# EAGLE design USB_Host (EAGLE 9.3.0)
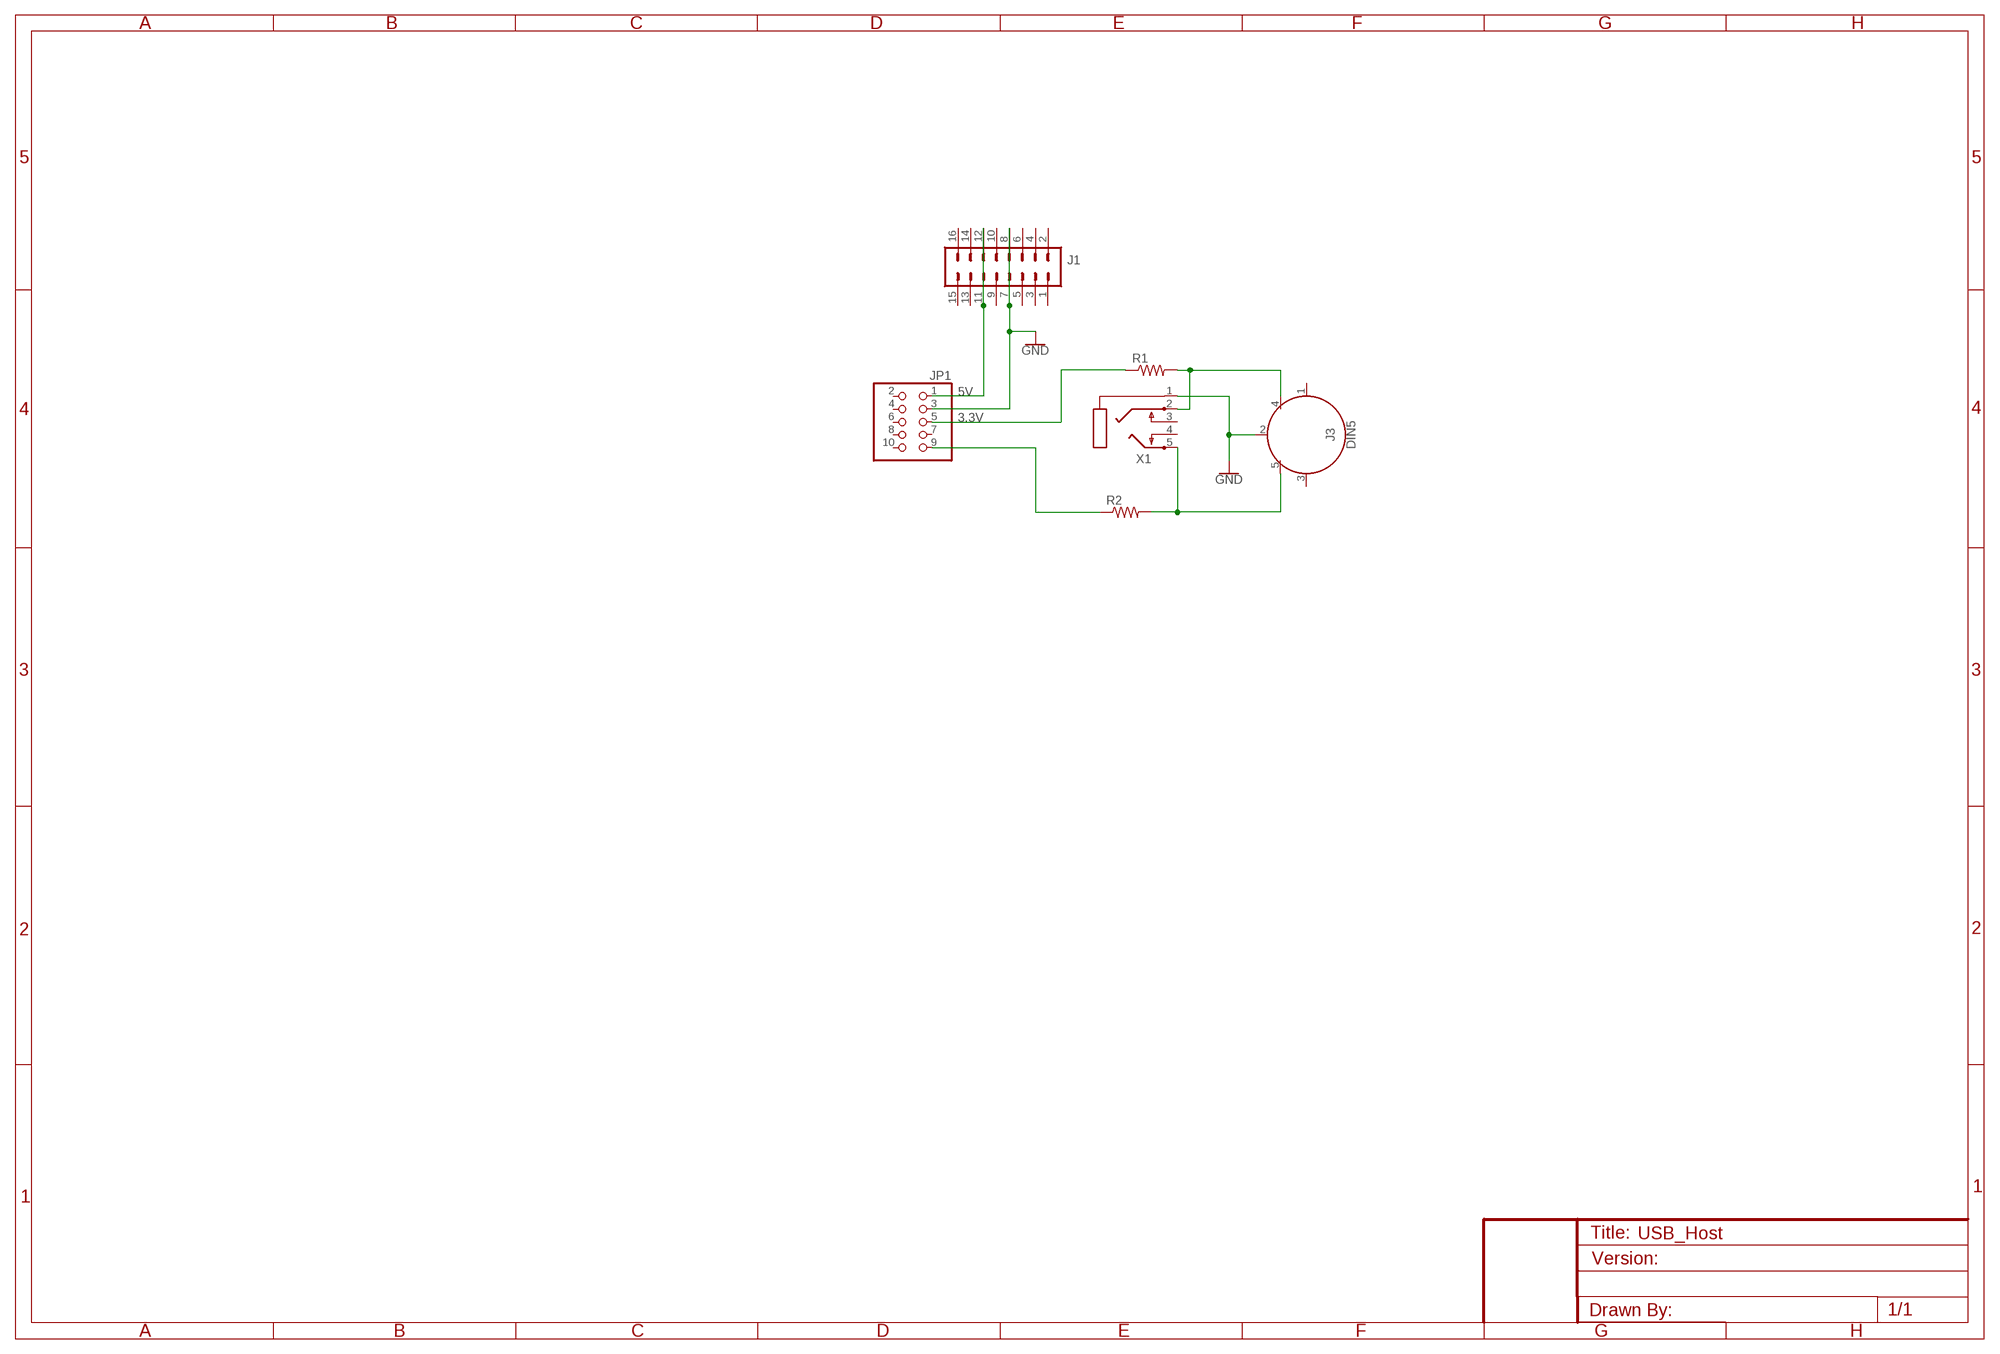
[diagram p0: schematic, sheet 1]

## Parts
J1  CONN_08X2_SHROUD  [2X8-SHROUDED_LOCK]
J3  DIN5  [DIN5-RA-PTH]
JP1  PINHD-2X5  [2X05]
R1  68  R-US_0204/7  [0204/7]
R2  68  R-US_0204/7  [0204/7]
X1  PG203J  [PG203J]

## Nets
3.3V: JP1.5 R1.1
5V: J1.11 J1.12 JP1.1
GND: J1.7 J1.8 J3.2 JP1.3 X1.1
N$1: JP1.9 R2.1
N$3: J3.4 R1.2 X1.2
N$4: J3.5 R2.2 X1.5
Unconnected: J1.1 J1.2 J1.3 J1.4 J1.5 J1.6 J1.9 J1.10 J1.13 J1.14 J1.15 J1.16 J3.1 J3.3 JP1.2 JP1.4 JP1.6 JP1.7 JP1.8 JP1.10 X1.3 X1.4

## Library data of the parts
J1 = SparkFun-Connectors:CONN_08X2: Multi connection point. Often used as Generic Header-pin footprint for 0.1 inch spaced/style header connections You can populate with any combo of single row headers, but if you'd like an exact match, check this: Header - 2x8 (Male, 0.1") <https://www.sparkfun.com/products/13156> (PRT-13156) On any of the 0.1 inch spaced packages, you can populate with these: Break Away Headers - Straight <https://www.sparkfun.com/products/116> (PRT-00116) Break Away Male Headers - Right Angle <https://www.sparkfun.com/products/553> (PRT-00553) Female Headers <https://www.sparkfun.com/products/115> (PRT-00115) Break Away Headers - Machine Pin <https://www.sparkfun.com/products/117> (PRT-00117) Break Away Female Headers - Swiss Machine Pin <https://www.sparkfun.com/products/743> (PRT-00743)
J3 = SparkFun-Connectors:DIN5: DIN5 Connector - Female Right Angle (frequently used as a MIDI Jack connector) This type of connector and cable is frequently used for transmitting midi data (musical instrument digital interface). It is what you usually see on a keyboard or set of electronic drums. Learn more here <https://en.wikipedia.org/wiki/MIDI>. For more information on the pinout and electrical specifications of MIDI communications, please see the following resource: https://www.midi.org/specifications/item/midi-din-electrical-specification Here is the connector we sell at SparkFun: MIDI Connector - Female Right Angle <https://www.sparkfun.com/products/9536> (PRT-09536) Datasheet <hhttp://www.sparkfun.com/datasheets/Prototyping/Connectors/MIDI-RA.pdf> It is used on this SparkFun product: SparkFun MIDI Shield <https://www.sparkfun.com/products/12898> (DEV-12898); PROD_ID: CONN-09481
JP1 = pinhead:PINHD-2X5: PIN HEADER
R1 R2 = adafruit:R-US_: RESISTOR, American symbol
X1 = con-hirschmann:PG203J: MIC/HEADPHONE JACK KS-S stereo microphone/headphone jack PG203JN (Schukat); OC_FARNELL: unknown; OC_NEWARK: unknown

## Net classes
0 default: width 0.508 mm, drill 1.016 mm, clearance 0.508 mm

## Board
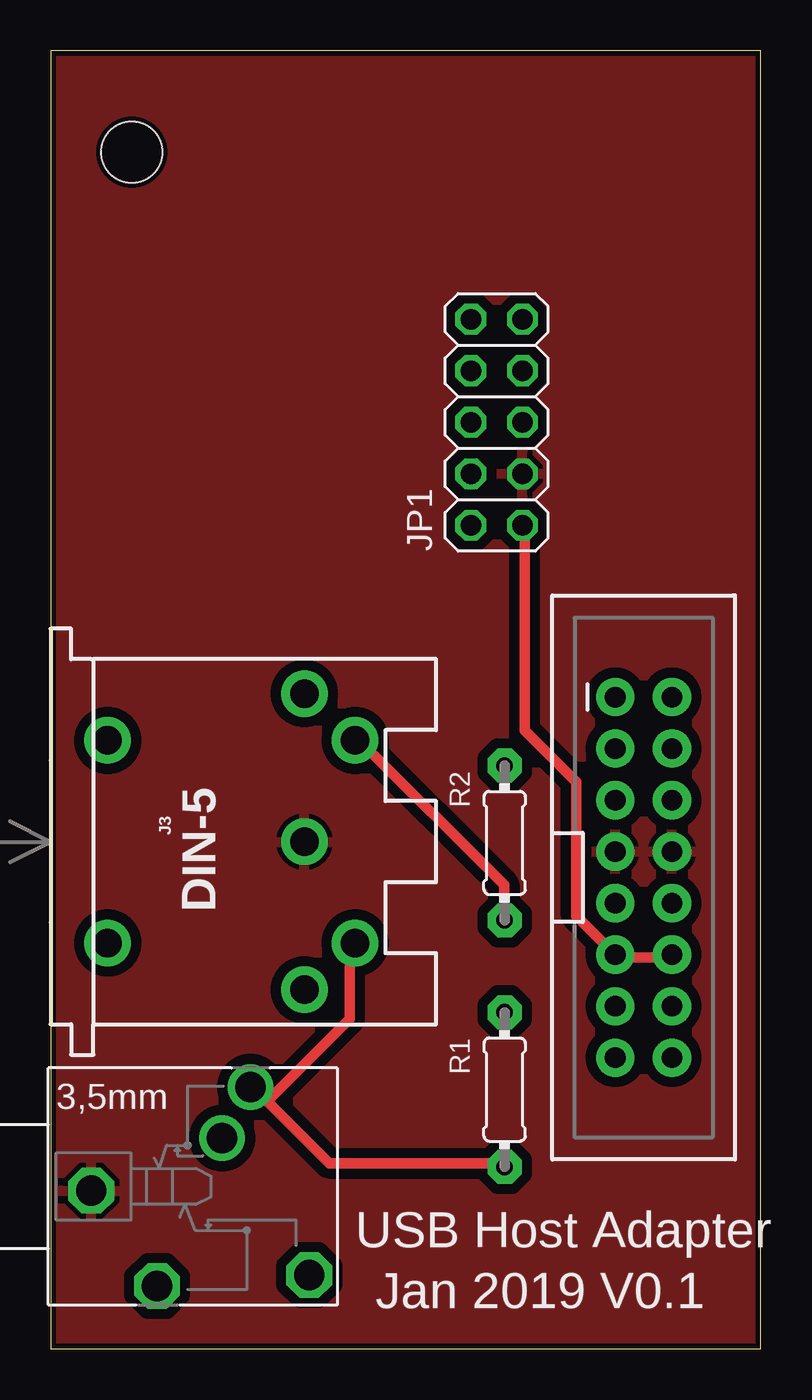
[diagram p1: board, top side]
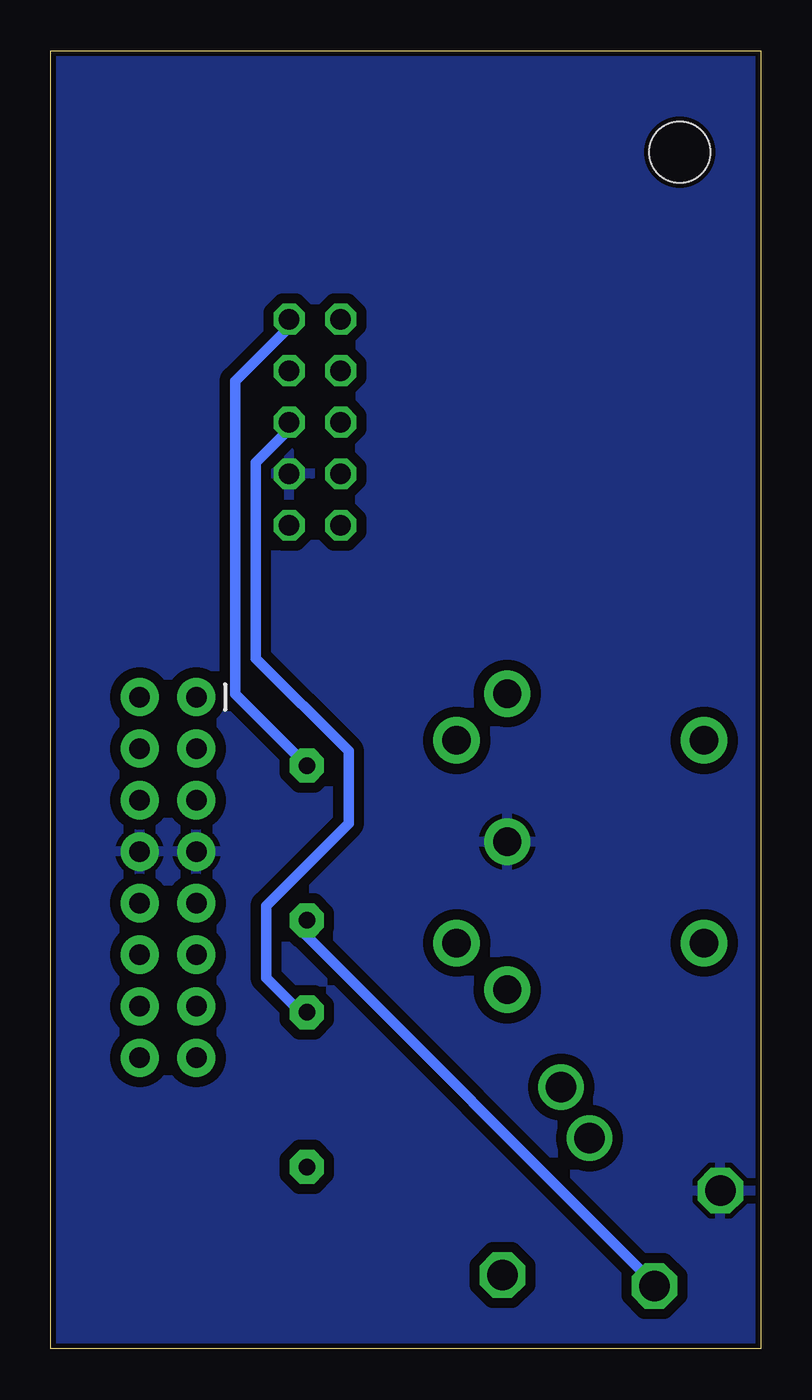
[diagram p2: board, bottom side, seen from below]

Size 35 x 64 mm. Coordinates in mm from the lower left corner, seen from the top.
Outline: 0,0 35,0 35,64 0,64 0,0
Copper layers (1*16): Top 0.035mm / dielectric 1.5mm / Bottom 0.035mm
Design rules "dirt_cheap_dirty_boards.v1.1": minimum track width 6mil, minimum drill 12mil, track to track 6mil, track to pad 6mil, pad to pad 6mil, via to via 6mil, smd to smd 0mil, copper to edge 10mil, drill to drill 10mil, minimum pad ring 10mil, minimum via ring 6mil, stop-mask expansion 2mil, vias tented up to drill 25mil, thermal gap 10mil
Holes 3 mm at 4,59

### Footprints (pad centres in the part's own frame; a part is rotated, then mirrored left to right if it is on the bottom)
2X8-SHROUDED_LOCK = drill 1.016 pad 1.88: 1 -1.397,8.89; 2 1.397,8.89; 3 -1.397,6.35; 4 1.397,6.35; 5 -1.397,3.81; 6 1.397,3.81; 7 -1.397,1.27; 8 1.397,1.27; 9 -1.397,-1.27; 10 1.397,-1.27; 11 -1.397,-3.81; 12 1.397,-3.81; 13 -1.397,-6.35; 14 1.397,-6.35; 15 -1.397,-8.89; 16 1.397,-8.89
DIN5-RA-PTH = drill 1.4 pad 2.286: 1 7.3,12.5; 2 0,12.5; 3 -7.3,12.5; 4 5,15; 5 -5,15; 6 -5,2.8; 7 5,2.8
2X05 = drill 1.016 octagon: 1 -5.08,-1.27; 2 -5.08,1.27; 3 -2.54,-1.27; 4 -2.54,1.27; 5 0,-1.27; 6 0,1.27; 7 2.54,-1.27; 8 2.54,1.27; 9 5.08,-1.27; 10 5.08,1.27
0204/7 = drill 0.813 pad 1.676 octagon: 1 -3.81,0; 2 3.81,0
PG203J = drill 1.499 octagon: 1 -5.004,-0.203; 4 5.74,-4.369; 5 -1.753,-4.902 | drill 1.499: 2 2.845,4.902; 3 1.448,2.388

### Placement (x,y rotation side)
J1  29.22,23.24 0 top
J3  0,25 270 top
JP1  21.98,45.68 90 top
R1  22.37,12.78 270 top
R2  22.37,24.94 270 top
X1  7,8 0 top

### Tracks (layer width: path | path; a pad name or v marks a point on that pad's centre or on a via)
3.3V
  Bottom 0.508: JP1.5 23.37,45.21 24.89,43.69 24.89,34.04 20.32,29.46 20.32,25.91 24.38,21.84 24.38,18.29 22.86,16.76 R1.1
5V
  Top 0.508: JP1.1 23.37,40.13 23.37,30.48 25.91,27.94 25.91,21.34 27.43,19.81 J1.11 27.94,19.3 30.48,19.3 J1.12
GND
  pour Bottom: 0,64 0,0 35,0 35,64
  pour Top: 0,64 0,0 35,0 35,64
N$1
  Bottom 0.508: JP1.9 23.25,50.38 25.91,47.72 25.91,32.29 R2.1
N$3
  Top 0.508: 10.67,12.19 10.16,12.7 X1.2 10.67,12.19 | 10.67,12.19 13.72,9.14 22.35,9.14 R1.2 | 10.67,12.19 14.73,16.26 14.73,19.81 J3.4
N$4
  Top 0.508: R2.2 22.35,21.34 22.35,22.86 15.24,29.97 J3.5
  Bottom 0.508: X1.5 5.59,3.56 22.86,20.83 R2.2

### Text on the board
tPlace: USB Host Adapter | Jan 2019 V0.1